# Altium schematic sheet MCU.SchDoc
size A4; SheetNumber: 1; SheetTotal: 3
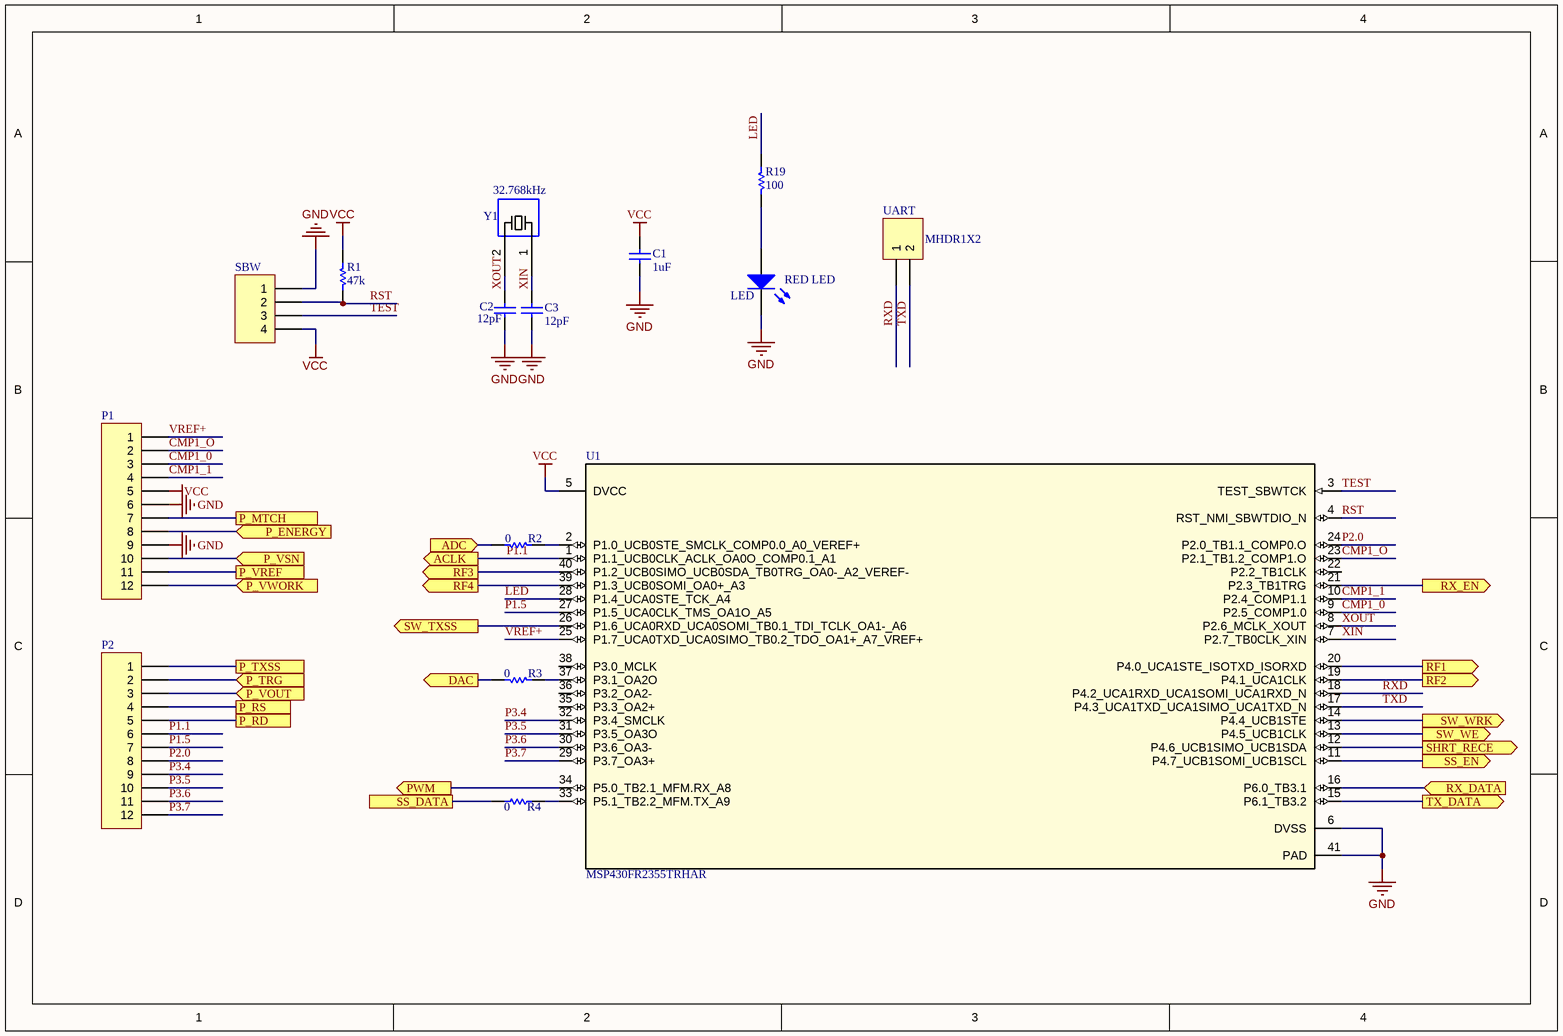
[diagram p0: MCU.SchDoc]

## Parts
C1  value 1uF  [0402]
C2  value 12pF  [0402]
C3  value 12pF  [0402]
LED  RED LED  [Diode - 0603]
P1  (no value)  [MHDR1X12]
P2  (no value)  [MHDR1X12]
R1  value 47k  [0402]
R2  value 0  [0402]
R3  value 0  [0402]
R4  value 0  [0402]
R19  value 100  [0402]
SBW  (no value)  [MHDR1X4]
U1  MSP430FR2355TRHAR  [MSP430FR2355TRHA_RHA0040E]
UART  MHDR1X2  [MHDR1X2]
Y1  value 32.768kHz  [XTAL [3.20mm x 1.50mm]]  (hidden comment: XTAL)

## Ports
ACLK (out), ADC (in), DAC (out), P_ENERGY (in), P_MTCH, P_RD, P_RS, P_TRG (in), P_TXSS, P_VOUT (in), P_VREF, P_VSN (in), P_VWORK (in), PWM (out), RF1 (out), RF2 (out), RF3 (out), RF4 (out), RX_DATA (in), RX_EN (out), SHRT_RECE (out), SS_DATA, SS_EN (out), SW_TXSS (out), SW_WE (out), SW_WRK (out), TX_DATA (out)

## Nets
GND: C1.2 C2.2 C3.2 LED.2(K) P1.6 P1.9 SBW.1 U1.6(DVSS) U1.41(PAD)
VCC: C1.1 P1.5 R1.2 SBW.4 U1.5(DVCC)
ADC: R2.2 ; port ADC
CMP1_0: P1.3 U1.9(P2.5_COMP1.0)
CMP1_1: P1.4 U1.10(P2.4_COMP1.1)
CMP1_O: P1.2 U1.23(P2.1_TB1.2_COMP1.O)
DAC: R3.2 ; port DAC
LED: R19.2 U1.28(P1.4_UCA0STE_TCK_A4)
P1.1: P2.6 U1.1(P1.1_UCB0CLK_ACLK_OA0O_COMP0.1_A1) ; port ACLK
P1.5: P2.7 U1.27(P1.5_UCA0CLK_TMS_OA1O_A5)
P2.0: P2.8 U1.24(P2.0_TB1.1_COMP0.O)
P3.4: P2.9 U1.32(P3.4_SMCLK)
P3.5: P2.10 U1.31(P3.5_OA3O)
P3.6: P2.11 U1.30(P3.6_OA3-)
P3.7: P2.12 U1.29(P3.7_OA3+)
P_ENERGY: P1.8 ; port P_ENERGY
P_MTCH: P1.7 ; port P_MTCH
P_RD: P2.5 ; port P_RD
P_RS: P2.4 ; port P_RS
P_TRG: P2.2 ; port P_TRG
P_TXSS: P2.1 ; port P_TXSS
P_VOUT: P2.3 ; port P_VOUT
P_VREF: P1.11 ; port P_VREF
P_VSN: P1.10 ; port P_VSN
P_VWORK: P1.12 ; port P_VWORK
PWM: U1.34(P5.0_TB2.1_MFM.RX_A8) ; port PWM
RF1: U1.20(P4.0_UCA1STE_ISOTXD_ISORXD) ; port RF1
RF2: U1.19(P4.1_UCA1CLK) ; port RF2
RF3: U1.40(P1.2_UCB0SIMO_UCB0SDA_TB0TRG_OA0-_A2_VEREF-) ; port RF3
RF4: U1.39(P1.3_UCB0SOMI_OA0+_A3) ; port RF4
RST: R1.1 SBW.2 U1.4(RST_NMI_SBWTDIO_N)
RX_DATA: U1.16(P6.0_TB3.1) ; port RX_DATA
RX_EN: U1.21(P2.3_TB1TRG) ; port RX_EN
RXD: U1.18(P4.2_UCA1RXD_UCA1SOMI_UCA1RXD_N) UART.1
SHRT_RECE: U1.12(P4.6_UCB1SIMO_UCB1SDA) ; port SHRT_RECE
SS_DATA: R4.1 ; port SS_DATA
SS_EN: U1.11(P4.7_UCB1SOMI_UCB1SCL) ; port SS_EN
SW_TXSS: U1.26(P1.6_UCA0RXD_UCA0SOMI_TB0.1_TDI_TCLK_OA1-_A6) ; port SW_TXSS
SW_WE: U1.13(P4.5_UCB1CLK) ; port SW_WE
SW_WRK: U1.14(P4.4_UCB1STE) ; port SW_WRK
TEST: SBW.3 U1.3(TEST_SBWTCK)
TX_DATA: U1.15(P6.1_TB3.2) ; port TX_DATA
TXD: U1.17(P4.3_UCA1TXD_UCA1SIMO_UCA1TXD_N) UART.2
VREF+: P1.1 U1.25(P1.7_UCA0TXD_UCA0SIMO_TB0.2_TDO_OA1+_A7_VREF+)
XIN: C3.1 U1.7(P2.7_TB0CLK_XIN) Y1.1
XOUT: C2.1 U1.8(P2.6_MCLK_XOUT) Y1.2
NetLED_1: LED.1(A) R19.1
NetR2_1: R2.1 U1.2(P1.0_UCB0STE_SMCLK_COMP0.0_A0_VEREF+)
NetR3_1: R3.1 U1.37(P3.1_OA2O)
NetR4_2: R4.2 U1.33(P5.1_TB2.2_MFM.TX_A9)

Not connected (* = marked no-connect by the designer): U1 22(P2.2_TB1CLK) 35(P3.3_OA2+) 36(P3.2_OA2-) 38(P3.0_MCLK)

## Notes on the sheet
- DWG. NO.
- REV.
- SHT.
- REVISION
- DESCRIPTION
- DATE
- APPROVED
- THIS DOCUMENT AND THE DATA DISCLOSED HEREIN OR HEREWITH IS THE PROPERTY OF ALTIUM LIMITED AND MAY BE FREELY DISTRIBUTED IN WHOLE. NO RIGHTS ARE RESERVED OR EXPRESS OR IMPLIED WARANTEE GIVEN.
- ENG:
- DSN:
- APPROVALS
- PROJECT
- DOCUMENT REVISION:
- DESIGN ITEM:
- CHK:
- BOM:
- REFERENCE DOCUMENTS
- PROJECT REVISION:
- TITLE
- FAB DWG:
- PCB DWG:
- ASSY DWG:
- SCALE:
- SIZE
- C
- CAGE CODE
- FILE NAME
- DWG NO.
- SHEET
- OF
- REV

## Library data of the parts
C1-C3 = Cap: Ceramic Capacitor (Surface Mount); Manufacturer: Generic Ceramic Chip Cap (TBD); Digi-Key Part Number: *; Manufacturer Part Number: *; Note: *; Rating: *
LED = Diode - LED: Typical RED, GREEN, YELLOW, AMBER GaAs LED; Digi-Key Part Number: *; Manufacturer: *; Manufacturer Part Number: *; Note: *; Value: *; Rating: *
P1 P2 = MHDR1X12: Header, 12-Pin; LatestRevisionDate: 17-Jul-2002; LatestRevisionNote: Re-released for DXP Platform.; Publisher: Altium Limited
R1-R4 R19 = Res: Chip Resistor (Surface Mount); Manufacturer: Panasonic; Manufacturer Part Number: ERJ-2RKF4702X; Digi-Key Part Number: P47.0KLCT-ND; Rating: *; Note: *
SBW = MHDR1X4: Header, 4-Pin; Manufacturer Part Number: 851-43-004-20-001000; Manufacturer: Mill-Max Manufacturing; Digi-Key Part Number: ED90474-ND
U1 = MSP430FR2355TRHAR: 24MHz 105C integrated analog microcontroller with 32KB FRAM, Op-Amps/PGAs, 12-bit DACs, 12-bit ADC; Mfr_Name: Texas Instruments; Type: DEV; RefDes: RefDes; Copyright: Copyright (C) 2022 Ultra Librarian. All rights reserved.; Manufacturer_Part_Number: MSP430FR2355TRHAR
UART = MHDR1X2: Header, 2-Pin; LatestRevisionDate: 17-Jul-2002; LatestRevisionNote: Re-released for DXP Platform.; Publisher: Altium Limited
Y1 = XTAL 2-pins: Crystal Oscillator - [3.20mm x 1.50mm]; Manufacturer: Epson Toyocom Corporation; Manufacturer Part Number: FC-135 32.7680KA-A3; Digi-Key Part Number: example: SE2413CT-ND